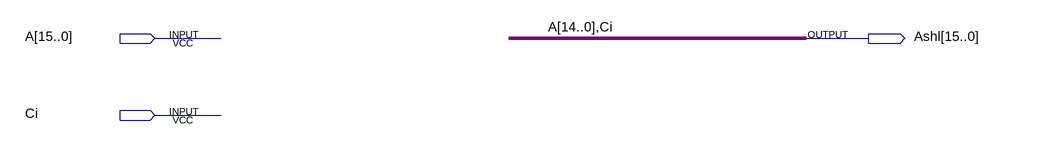
[diagram p0: schematic sheet]
// Quartus schematic SHL16.bdf as structural Verilog: 0 symbols, 3 pins
module SHL16 (
  input  [15:0] A,
  input  Ci,
  output [15:0] Ashl
);


  assign Ashl = {A[14:0], Ci};
endmodule
